# Altium schematic sheet uC.SchDoc: uC
size A3; SheetNumber: 5; SheetTotal: 10
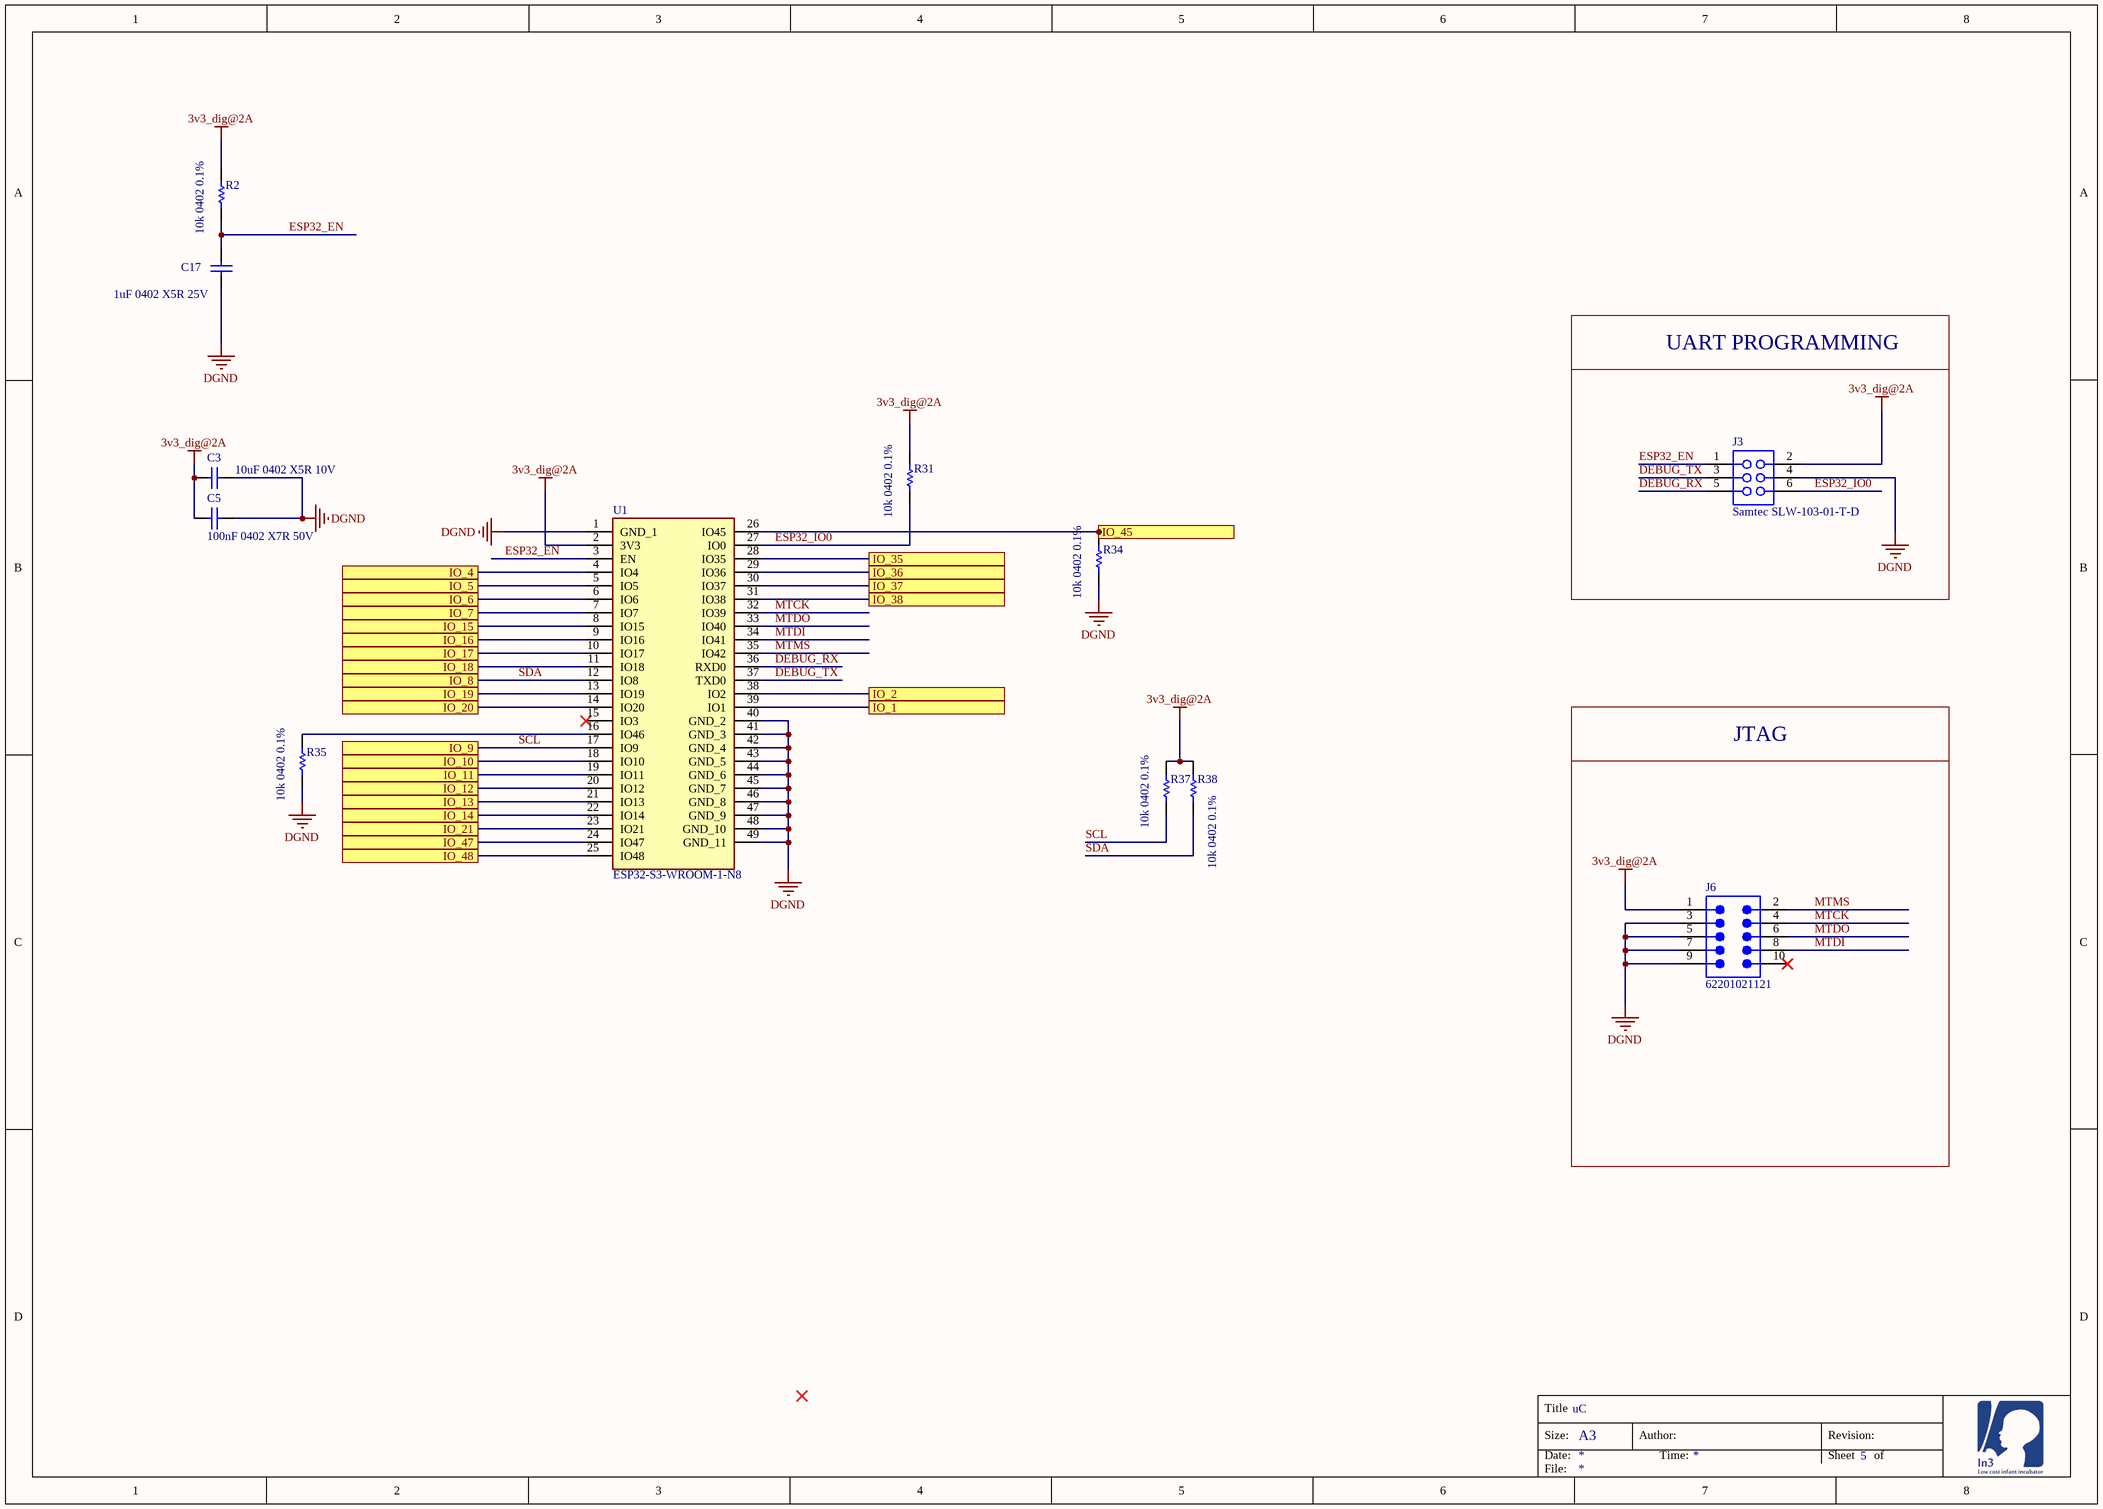
[diagram p0: uC.SchDoc]

## Parts
C3  10uF 0402 X5R 10V  [CAPC1005X55X25NL5T10]
C5  100nF 0402 X7R 50V  [CAPC1005X55X25NL5T10]
C17  1uF 0402 X5R 25V  [CAPC1005X55X25NL5T10]
J3  Samtec SLW-103-01-T-D  [PCB-37z8hw1ej4f71bosen9e-1]
J6  62201021121  [62201021121]
R2  10k 0402 0.1%  [RESC1005X40X25ML05T10]
R31  10k 0402 0.1%  [RESC1005X40X25ML05T10]
R34  10k 0402 0.1%  [RESC1005X40X25ML05T10]
R35  10k 0402 0.1%  [RESC1005X40X25ML05T10]
R37  10k 0402 0.1%  [RESC1005X40X25ML05T10]
R38  10k 0402 0.1%  [RESC1005X40X25ML05T10]
U1  ESP32-S3-WROOM-1-N8  [ESP32S3WROOM1N8R2]

## Blocks framed on the sheet
UART PROGRAMMING: J3
JTAG: J6

## Ports
IO_1, IO_2, IO_4, IO_5, IO_6, IO_7, IO_8, IO_9, IO_10, IO_11, IO_12, IO_13, IO_14, IO_15, IO_16, IO_17, IO_18, IO_19, IO_20, IO_21, IO_35, IO_36, IO_37, IO_38, IO_45, IO_47, IO_48

## Nets
3v3_dig@2A: C3.2 C5.2 J3.2 J6.1 R2.2 R31.2 R37.2 R38.2 U1.2(3V3)
DGND: C3.1 C5.1 C17.1 J3.4 J6.3 J6.5 J6.7 J6.9 R34.1 R35.1 U1.1(GND_1) U1.40(GND_2) U1.41(GND_3) U1.42(GND_4) U1.43(GND_5) U1.44(GND_6) U1.45(GND_7) U1.46(GND_8) U1.47(GND_9) U1.48(GND_10) U1.49(GND_11)
DEBUG_RX: J3.5 U1.36(RXD0)
DEBUG_TX: J3.3 U1.37(TXD0)
ESP32_EN: C17.2 J3.1 R2.1 U1.3(EN)
ESP32_IO0: J3.6 R31.1 U1.27(IO0)
IO_1: U1.39(IO1) ; port IO_1
IO_2: U1.38(IO2) ; port IO_2
IO_4: U1.4(IO4) ; port IO_4
IO_5: U1.5(IO5) ; port IO_5
IO_6: U1.6(IO6) ; port IO_6
IO_7: U1.7(IO7) ; port IO_7
IO_10: U1.18(IO10) ; port IO_10
IO_11: U1.19(IO11) ; port IO_11
IO_12: U1.20(IO12) ; port IO_12
IO_13: U1.21(IO13) ; port IO_13
IO_14: U1.22(IO14) ; port IO_14
IO_15: U1.8(IO15) ; port IO_15
IO_16: U1.9(IO16) ; port IO_16
IO_17: U1.10(IO17) ; port IO_17
IO_18: U1.11(IO18) ; port IO_18
IO_19: U1.13(IO19) ; port IO_19
IO_20: U1.14(IO20) ; port IO_20
IO_21: U1.23(IO21) ; port IO_21
IO_35: U1.28(IO35) ; port IO_35
IO_36: U1.29(IO36) ; port IO_36
IO_37: U1.30(IO37) ; port IO_37
IO_38: U1.31(IO38) ; port IO_38
IO_45: R34.2 U1.26(IO45) ; port IO_45
IO_47: U1.24(IO47) ; port IO_47
IO_48: U1.25(IO48) ; port IO_48
MTCK: J6.4 U1.32(IO39)
MTDI: J6.8 U1.34(IO41)
MTDO: J6.6 U1.33(IO40)
MTMS: J6.2 U1.35(IO42)
SCL: R37.1 U1.17(IO9) ; port IO_9
SDA: R38.1 U1.12(IO8) ; port IO_8
NetR35_2: R35.2 U1.16(IO46)

Not connected (* = marked no-connect by the designer): J6 10*; U1 15(IO3)*

## Notes on the sheet
- Title
- Size:
- Date:
- A3
- Author:
- Time:
- Revision:
- Sheet
- of
- File:

## Library data of the parts
C3 C5 C17 = CMP-1662-00020-1: ComponentLink2Description: Datasheet; ComponentLink2URL: http://psearch.en.murata.com/capacitor/product/GRM155R60J105KE19%23.pdf; ComponentLink1Description: Manufacturer URL; ComponentLink1URL: http://www.murata.com/
  C3: LCSC_PN: C77000
  C5: LCSC_PN: C77020
  C17: LCSC_PN: C77009
J3 = CMP-bcf575fbeff46332-1: Dual Row Connector Female Samtec SLW-103-01-T-D; Lead-Free Status: Lead Free; Number of Contacts: 6; Pin Pitch: 2.54 mm; Voltage Rating (AC): 400 V; Gender: Female; Color: Black; Octopart URL: https://octopart.com/slw-103-01-t-d-samtec-292455; Mounting Style: Through Hole, Vertical; Contact Plating: Tin; OctopartID: bcf575fbeff46332; Operating Temperature: 105 °C (max); Size-Width: 4.95 mm; Housing Material: Plastic; Size-Length: 7.62 mm; Number of Rows: 2; Size-Height: 4.57 mm; Packaging: Tube; RoHS: Compliant; Contact Material: Phosphor Bronze; Number of Positions: 6; Housing Color: Black; REACH SVHC Compliance: No SVHC; Manufacturer Part Number: SLW-103-01-T-D; LCSC_PN: C492420
J6 = CMP-1502-00948-3: NexarPartId: 32855586; Pitch: 1.27mm; Operating Supply Voltage: 100V; Connector Type: Male Pin; Contact Resistance: 20mΩ; Current Rating: 1A; Number of Contacts: 10; Gender: Male; Contact Mating Length: 3.81mm; Max Operating Temperature: 105°C; Mount: Through Hole; Number of Pins: 10; Row Spacing: 1.27mm; Lead Pitch: 1.27mm; REACH SVHC: Unknown; Min Operating Temperature: -40°C; Contact Material: Copper; Orientation: Vertical; Contact Plating: Gold; Number of Rows: 2; RoHS: Compliant; Packaging: Box; Voltage Rating: 100V; Color: Black; Height: 5.65mm; Termination: Solder; Number of Positions: 10; LCSC_PN: C7501289
R2 R31 R34 R35 R37 R38 = CMP-2002-07472-1: LCSC_PN: C190095
U1 = ESP32-S3-WROOM-1-N8: Integrated Circuit; Manufacturer_Name: Espressif Systems; Datasheet Link: https://www.espressif.com/sites/default/files/documentation/esp32-s3-wroom-1_wroom-1u_datasheet_en.pdf; Height: 3.25mm; Manufacturer_Part_Number: ESP32-S3-WROOM-1-N8; Mouser Part Number: 356-ESP32-S3WROOM1N8; Mouser Price/Stock: https://www.mouser.co.uk/ProductDetail/Espressif-Systems/ESP32-S3-WROOM-1-N8?qs=Wj%2FVkw3K%252BMC1mq0KGPvoSQ%3D%3D; LCSC_PN: C2913198